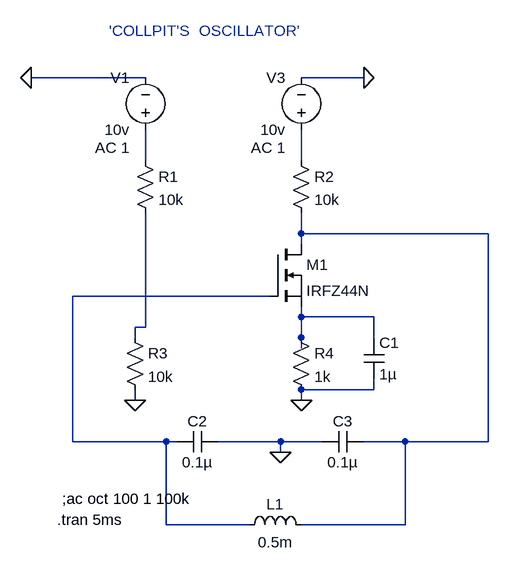
[diagram p0: schematic 12.Collpits Oscillator.asc]
12.Collpits Oscillator.asc, the LTspice schematic file:
Version 4
SHEET 1 880 856
WIRE 160 64 -16 64
WIRE 496 64 400 64
WIRE 160 192 160 144
WIRE 400 192 400 144
WIRE 400 304 400 272
WIRE 688 304 400 304
WIRE 400 320 400 304
WIRE 352 400 48 400
WIRE 400 432 400 416
WIRE 512 432 400 432
WIRE 160 448 160 272
WIRE 160 448 144 448
WIRE 144 464 144 448
WIRE 400 464 400 432
WIRE 512 464 512 432
WIRE 400 480 400 464
WIRE 512 544 512 528
WIRE 512 544 400 544
WIRE 144 560 144 544
WIRE 400 560 400 544
WIRE 48 624 48 400
WIRE 192 624 48 624
WIRE 208 624 192 624
WIRE 368 624 272 624
WIRE 432 624 368 624
WIRE 560 624 496 624
WIRE 688 624 688 304
WIRE 688 624 560 624
WIRE 368 640 368 624
WIRE 192 752 192 624
WIRE 320 752 192 752
WIRE 560 752 560 624
WIRE 560 752 400 752
FLAG -16 64 0
FLAG 496 64 0
FLAG 144 560 0
FLAG 400 560 0
FLAG 368 640 0
SYMBOL voltage 160 160 R180
WINDOW 0 24 96 Left 2
WINDOW 3 24 16 Left 2
WINDOW 123 24 -12 Left 2
WINDOW 39 0 0 Left 0
SYMATTR InstName V1
SYMATTR Value 10v
SYMATTR Value2 AC 1
SYMBOL voltage 400 160 R180
WINDOW 0 24 96 Left 2
WINDOW 3 24 16 Left 2
WINDOW 123 24 -12 Left 2
WINDOW 39 0 0 Left 0
SYMATTR InstName V3
SYMATTR Value 10v
SYMATTR Value2 AC 1
SYMBOL res 144 176 R0
SYMATTR InstName R1
SYMATTR Value 10k
SYMBOL res 384 176 R0
SYMATTR InstName R2
SYMATTR Value 10k
SYMBOL nmos 352 320 R0
SYMATTR InstName M1
SYMATTR Value IRFZ44N
SYMBOL res 128 448 R0
SYMATTR InstName R3
SYMATTR Value 10k
SYMBOL res 384 448 R0
SYMATTR InstName R4
SYMATTR Value 1k
SYMBOL cap 496 464 R0
SYMATTR InstName C1
SYMATTR Value 1µ
SYMBOL cap 272 608 R90
WINDOW 0 0 32 VBottom 2
WINDOW 3 32 32 VTop 2
SYMATTR InstName C2
SYMATTR Value 0.1µ
SYMBOL cap 496 608 R90
WINDOW 0 0 32 VBottom 2
WINDOW 3 32 32 VTop 2
SYMATTR InstName C3
SYMATTR Value 0.1µ
SYMBOL ind 304 768 R270
WINDOW 0 32 56 VTop 2
WINDOW 3 5 56 VBottom 2
SYMATTR InstName L1
SYMATTR Value 0.5m
TEXT 24 744 Left 2 !.tran 5ms
TEXT 32 712 Left 2 !;ac oct 100 1 100k
TEXT 104 -8 Left 2 ;'COLLPIT'S  OSCILLATOR'

The netlist it stands for:
* 12.Collpits Oscillator.asc
V1 N001 0 10v AC 1
V3 N002 0 10v AC 1
R1 N001 N006 10k
R2 N002 N003 10k
M1 N003 N004 N005 N005 IRFZ44N
R3 N006 0 10k
R4 N005 0 1k
C1 N005 0 1µ
C2 0 N004 0.1µ
C3 N003 0 0.1µ
L1 N004 N003 0.5m
.model NMOS NMOS
.model PMOS PMOS
.lib standard.mos
.tran 5ms
;ac oct 100 1 100k
* 'COLLPIT'S  OSCILLATOR'
.backanno
.end